# EAGLE design v0.1 (EAGLE 6.5.0)
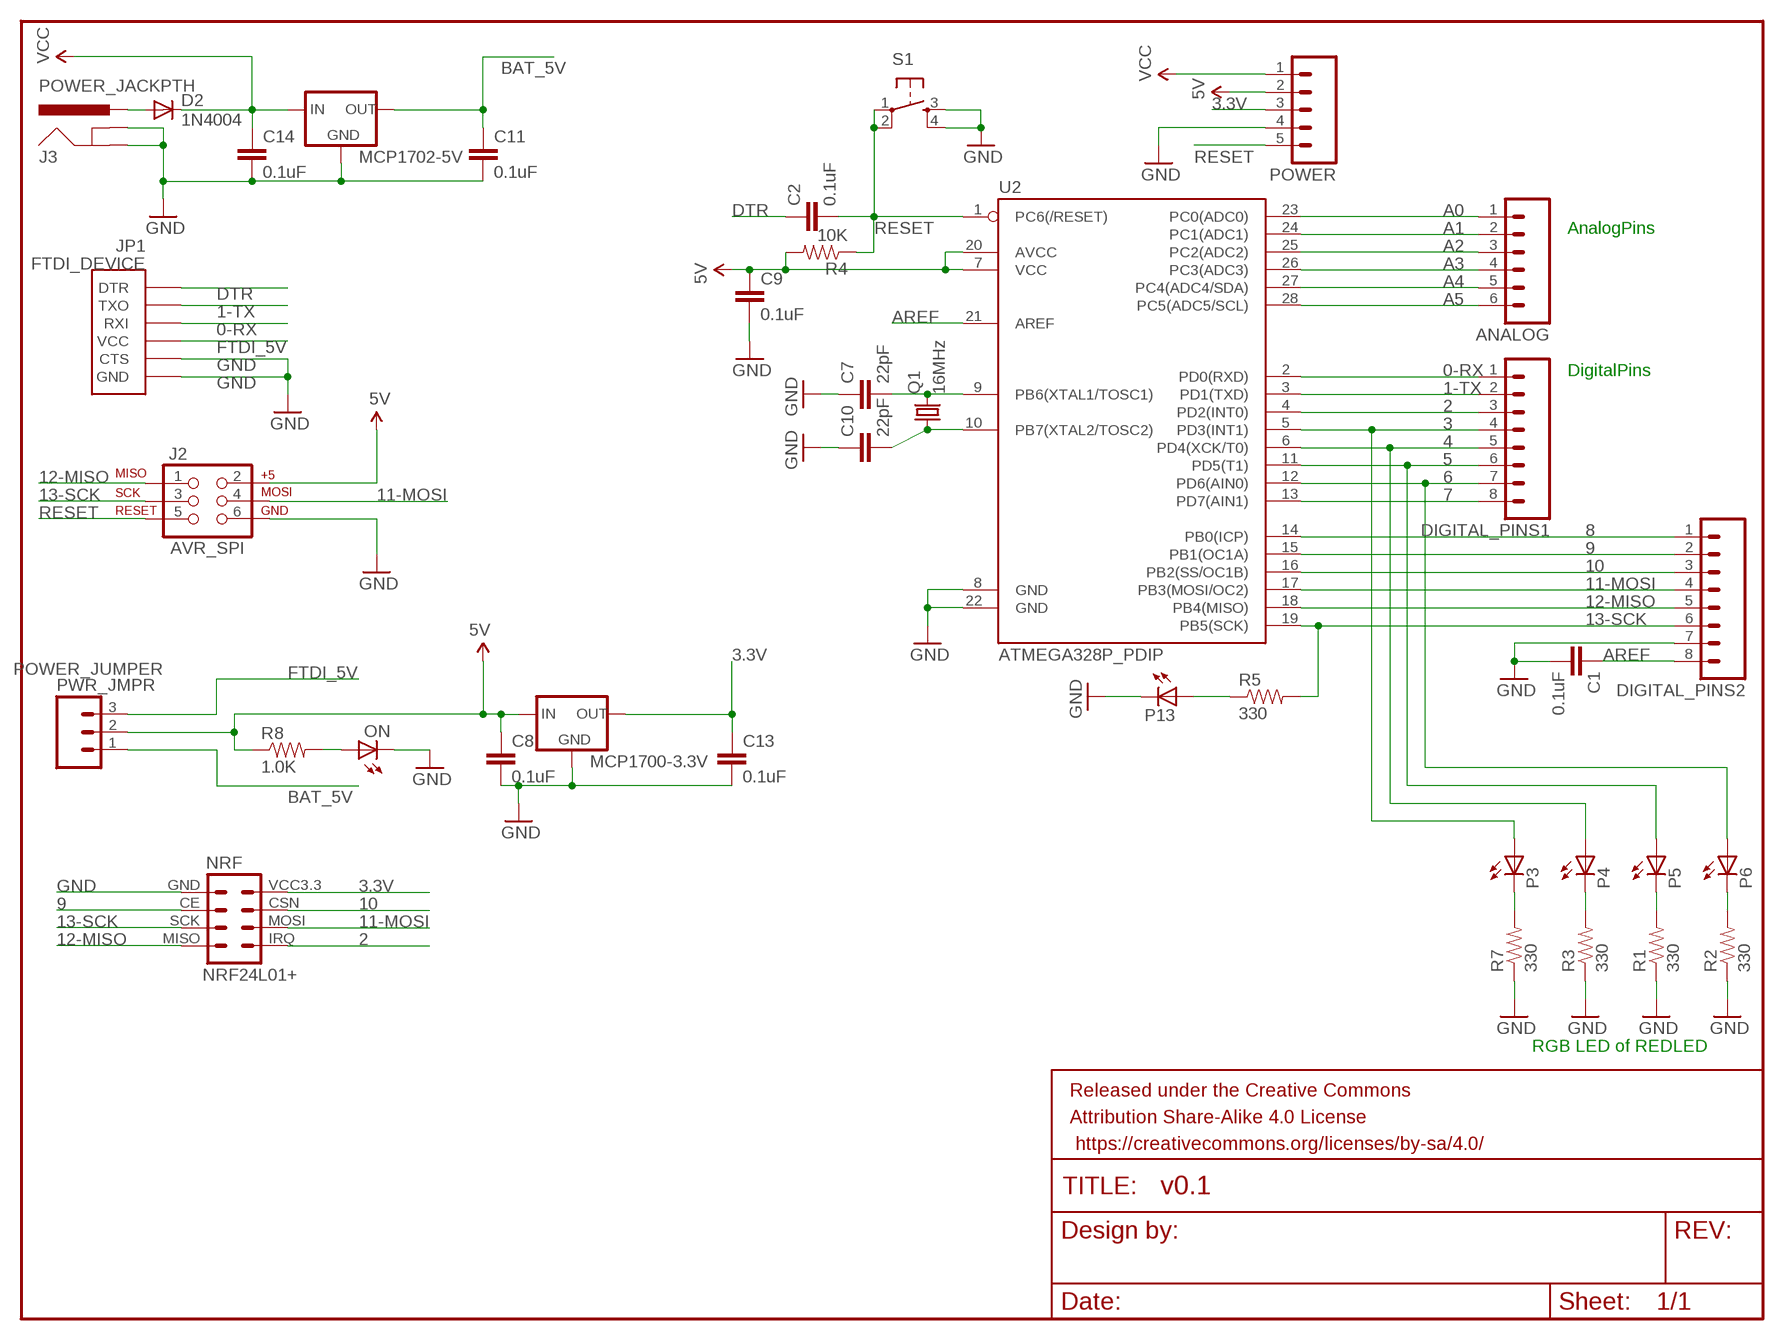
[diagram p0: schematic, sheet 1]

## Parts
ANALOG  M06LOCK  [1X06_LOCK]
C1  0.1uF  CAPPTH  [CAP-PTH-SMALL]
C2  0.1uF  CAPPTH  [CAP-PTH-SMALL]
C7  22pF  CAPPTH  [CAP-PTH-SMALL]
C8  0.1uF  CAPPTH  [CAP-PTH-SMALL]
C9  0.1uF  CAPPTH  [CAP-PTH-SMALL]
C10  22pF  CAPPTH  [CAP-PTH-SMALL]
C11  0.1uF  CAPPTH  [CAP-PTH-SMALL]
C13  0.1uF  CAPPTH  [CAP-PTH-SMALL]
C14  0.1uF  CAPPTH  [CAP-PTH-SMALL]
D2  1N4004  [DO41-10]
DIGITAL_PINS1  M08LOCK  [1X08_LOCK]
DIGITAL_PINS2  M08LOCK  [1X08_LOCK]
FRAME1  FRAME-LETTER  [CREATIVE_COMMONS]
J2  AVR_SPI  AVR_SPI_PRG_6PTH  [2X3]
J3  POWER_JACKPTH  [POWER_JACK_PTH]
JP1  FTDI_DEVICE  [FTDI_DEVICE_SIDE]
MCP1700-3.3V  MCP1700INLINE  [TO92-INLINE]
MCP1702-5V  MCP1700INLINE  [TO92-INLINE]
NRF  NRF24L01+  [2X4]
ON  LED3MM  [LED3MM]
P3  LED5MM  [LED5MM]
P4  LED5MM  [LED5MM]
P5  LED5MM  [LED5MM]
P6  LED5MM  [LED5MM]
P13  LED3MM  [LED3MM]
POWER  M05LOCK  [1X05_LOCK]
PWR_JMPR  M03LOCK  [1X03_LOCK]
Q1  16MHz  CRYSTALHC49S  [HC49/S]
R1  330  RESISTORPTH-1/4W  [AXIAL-0.4]
R2  330  RESISTORPTH-1/4W  [AXIAL-0.4]
R3  330  RESISTORPTH-1/4W  [AXIAL-0.4]
R4  10K  RESISTORPTH-1/4W  [AXIAL-0.4]
R5  330  RESISTORPTH-1/4W  [AXIAL-0.4]
R7  330  RESISTORPTH-1/4W  [AXIAL-0.4]
R8  1.0K  RESISTORPTH-1/4W  [AXIAL-0.4]
S1  TAC_SWITCHPTH  [TACTILE-PTH]
U2  ATMEGA328P_PDIP  [DIL28-3]

## Nets
0-RX: DIGITAL_PINS1.1 JP1.P$3(RXI) U2.2(PD0(RXD))
1-TX: DIGITAL_PINS1.2 JP1.P$2(TXO) U2.3(PD1(TXD))
2: DIGITAL_PINS1.3 NRF.IRQ U2.4(PD2(INT0))
3: DIGITAL_PINS1.4 P3.A U2.5(PD3(INT1))
3.3V: C13.1 MCP1700-3.3V.3(OUT) NRF.VCC3.3(VCC) POWER.3
4: DIGITAL_PINS1.5 P4.A U2.6(PD4(XCK/T0))
5: DIGITAL_PINS1.6 P5.A U2.11(PD5(T1))
5V: C8.1 C9.1 J2.2 MCP1700-3.3V.2(IN) POWER.2 PWR_JMPR.2 R4.P$2 R8.P$1 U2.7(VCC) U2.20(AVCC)
6: DIGITAL_PINS1.7 P6.A U2.12(PD6(AIN0))
7: DIGITAL_PINS1.8 U2.13(PD7(AIN1))
8: DIGITAL_PINS2.1 U2.14(PB0(ICP))
9: DIGITAL_PINS2.2 NRF.CE U2.15(PB1(OC1A))
10: DIGITAL_PINS2.3 NRF.CSN U2.16(PB2(SS/OC1B))
11-MOSI: DIGITAL_PINS2.4 J2.4 NRF.MOSI U2.17(PB3(MOSI/OC2))
12-MISO: DIGITAL_PINS2.5 J2.1 NRF.MISO U2.18(PB4(MISO))
13-SCK: DIGITAL_PINS2.6 J2.3 NRF.SCK R5.P$2 U2.19(PB5(SCK))
A0: ANALOG.1 U2.23(PC0(ADC0))
A1: ANALOG.2 U2.24(PC1(ADC1))
A2: ANALOG.3 U2.25(PC2(ADC2))
A3: ANALOG.4 U2.26(PC3(ADC3))
A4: ANALOG.5 U2.27(PC4(ADC4/SDA))
A5: ANALOG.6 U2.28(PC5(ADC5/SCL))
AREF: C1.1 DIGITAL_PINS2.8 U2.21(AREF)
B: P5.K(C) R1.P$2
B1: P3.K(C) R7.P$2
BAT_5V: C11.1 MCP1702-5V.3(OUT) PWR_JMPR.1
DTR: C2.1 JP1.P$1(DTR)
FTDI_5V: JP1.P$4(VCC) PWR_JMPR.3
GND: C1.2 C7.1 C8.2 C9.2 C10.1 C11.2 C13.2 C14.2 DIGITAL_PINS2.7 J2.6 J3.GND J3.GNDBREAK JP1.P$5(CTS) JP1.P$6(GND) MCP1700-3.3V.1(GND) MCP1702-5V.1(GND) NRF.GND ON.K(C) P13.K(C) POWER.4 R1.P$1 R2.P$1 R3.P$1 R7.P$1 S1.3 S1.4 U2.8(GND) U2.22(GND)
N$1: ON.A R8.P$2
N$2: P13.A R5.P$1
N$3: C10.2 Q1.1 U2.10(PB7(XTAL2/TOSC2))
N$4: C7.2 Q1.2 U2.9(PB6(XTAL1/TOSC1))
N$9: D2.A J3.PWR
N$12: P4.K(C) R3.P$2
N$13: P6.K(C) R2.P$2
RESET: C2.2 J2.5 POWER.5 R4.P$1 S1.1 S1.2 U2.1(PC6(/RESET))
VCC: C14.1 D2.C MCP1702-5V.2(IN) POWER.1

## Notes on the sheet
- AnalogPins
- DigitalPins
- RGB LED of REDLED

## Library data of the parts
ANALOG = SparkFun-Connectors:M06: Header 6 Standard 6-pin 0.1" header. Use with straight break away headers (SKU : PRT-00116), right angle break away headers (PRT-00553), swiss pins (PRT-00743), machine pins (PRT-00117), and female headers (PRT-00115). Molex polarized connector foot print use with SKU : PRT-08094 with associated crimp pins and housings. NOTES ON THE VARIANTS LOCK and LOCK_LONGPADS... This footprint was designed to help hold the alignment of a through-hole component (i.e. 6-pin header) while soldering it into place. You may notice that each hole has been shifted either up or down by 0.005 of an inch from it's more standard position (which is a perfectly straight line). This slight alteration caused the pins (the squares in the middle) to touch the edges of the holes. Because they are alternating, it causes a "brace" to hold the component in place. 0.005 has proven to be the perfect amount of "off-center" position when using our standard breakaway headers. Although looks a little odd when you look at the bare footprint, once you have a header in there, the alteration is very hard to notice. Also,if you push a header all the way into place, it is covered up entirely on the bottom side. This idea of altering the position of holes to aid alignment will be further integrated into the Sparkfun Library for other footprints. It can help hold any component with 3 or more connection pins.
C1 C2 C7-C11 C13 C14 = SparkFun-Capacitors:CAP: Capacitor Standard 0603 ceramic capacitor, and 0.1" leaded capacitor.
D2 = adafruit:1N4004: DIODE General purpose 1N400x type rectifier (With bigger pads) http://www.ladyada.net/library/pcb/eaglelibrary.html
DIGITAL_PINS1 DIGITAL_PINS2 = SparkFun-Connectors:M08: Header 8 Standard 8-pin 0.1" header. Use with straight break away headers (SKU : PRT-00116), right angle break away headers (PRT-00553), swiss pins (PRT-00743), machine pins (PRT-00117), and female headers (PRT-00115).
FRAME1 = SparkFun-Aesthetics:FRAME-LETTER: Schematic Frame Standard 8.5x11 US Letter frame
J2 = SparkFun-Connectors:AVR_SPI_PRG_6: AVR ISP 6 Pin This is the reduced ISP connector for AVR programming. Common on Arduino. This footprint will take up less PCB space and can be used with a 10-pin to 6-pin adapter such as SKU: BOB-08508
J3 = SparkFun-Connectors:POWER_JACK: Power Jack This is the standard 5.5mm barrel jack for power. The PTH is the most common, proven, reliable, footprint. The Slot footprint only works if the mill layer is transmitted to the PCB fab house so be warned. Mating wall wart : TOL-00298 (and others); PROD_ID: PRT-00119
JP1 = SparkFun-Connectors:FTDI_DEVICE: Connector which mates to FTDI basic or FTDI cable.
MCP1700-3.3V MCP1702-5V = adafruit:MCP1700: VOLTAGE REGULATOR
NRF = randomdata:NRF24L01+: .1" header, two rows of four.
ON P3-P6 P13 = SparkFun-LED:LED: LEDs Standard schematic elements and footprints for 5mm, 3mm, 1206, and 0603 sized LEDs. 5mm - Spark Fun Electronics SKU : COM-00529 (and others)
POWER = SparkFun-Connectors:M05: Header 5 Standard 5-pin 0.1" header. Use with straight break away headers (SKU : PRT-00116), right angle break away headers (PRT-00553), swiss pins (PRT-00743), machine pins (PRT-00117), and female headers (PRT-00115). Molex polarized connector foot print use with SKU : PRT-08230 with associated crimp pins and housings.
PWR_JMPR = SparkFun-Connectors:M03: Header 3 Standard 3-pin 0.1" header. Use with straight break away headers (SKU : PRT-00116), right angle break away headers (PRT-00553), swiss pins (PRT-00743), machine pins (PRT-00117), and female headers (PRT-00115). Molex polarized connector foot print use with SKU : PRT-08232 with associated crimp pins and housings.
Q1 = crystal:CRYSTAL: CRYSTAL; OC_FARNELL: 1667008; OC_NEWARK: unknown
R1-R5 R7 R8 = SparkFun-Passives:RESISTOR: Resistor Basic schematic elements and footprints for 0603, 1206, and PTH resistors.
S1 = SparkFun-Electromechanical:TAC_SWITCH: Momentary Switch Button commonly used for reset or general input. Spark Fun Electronics SKU : COM-00097 SMT- SWCH-08247
U2 = SparkFun-DigitalIC:ATMEGA328P_PDIP: uC used in the Arduino 32kb flash, 1k EEPROM, 2k SRAM This is the through-hole version of this chip.

## Board
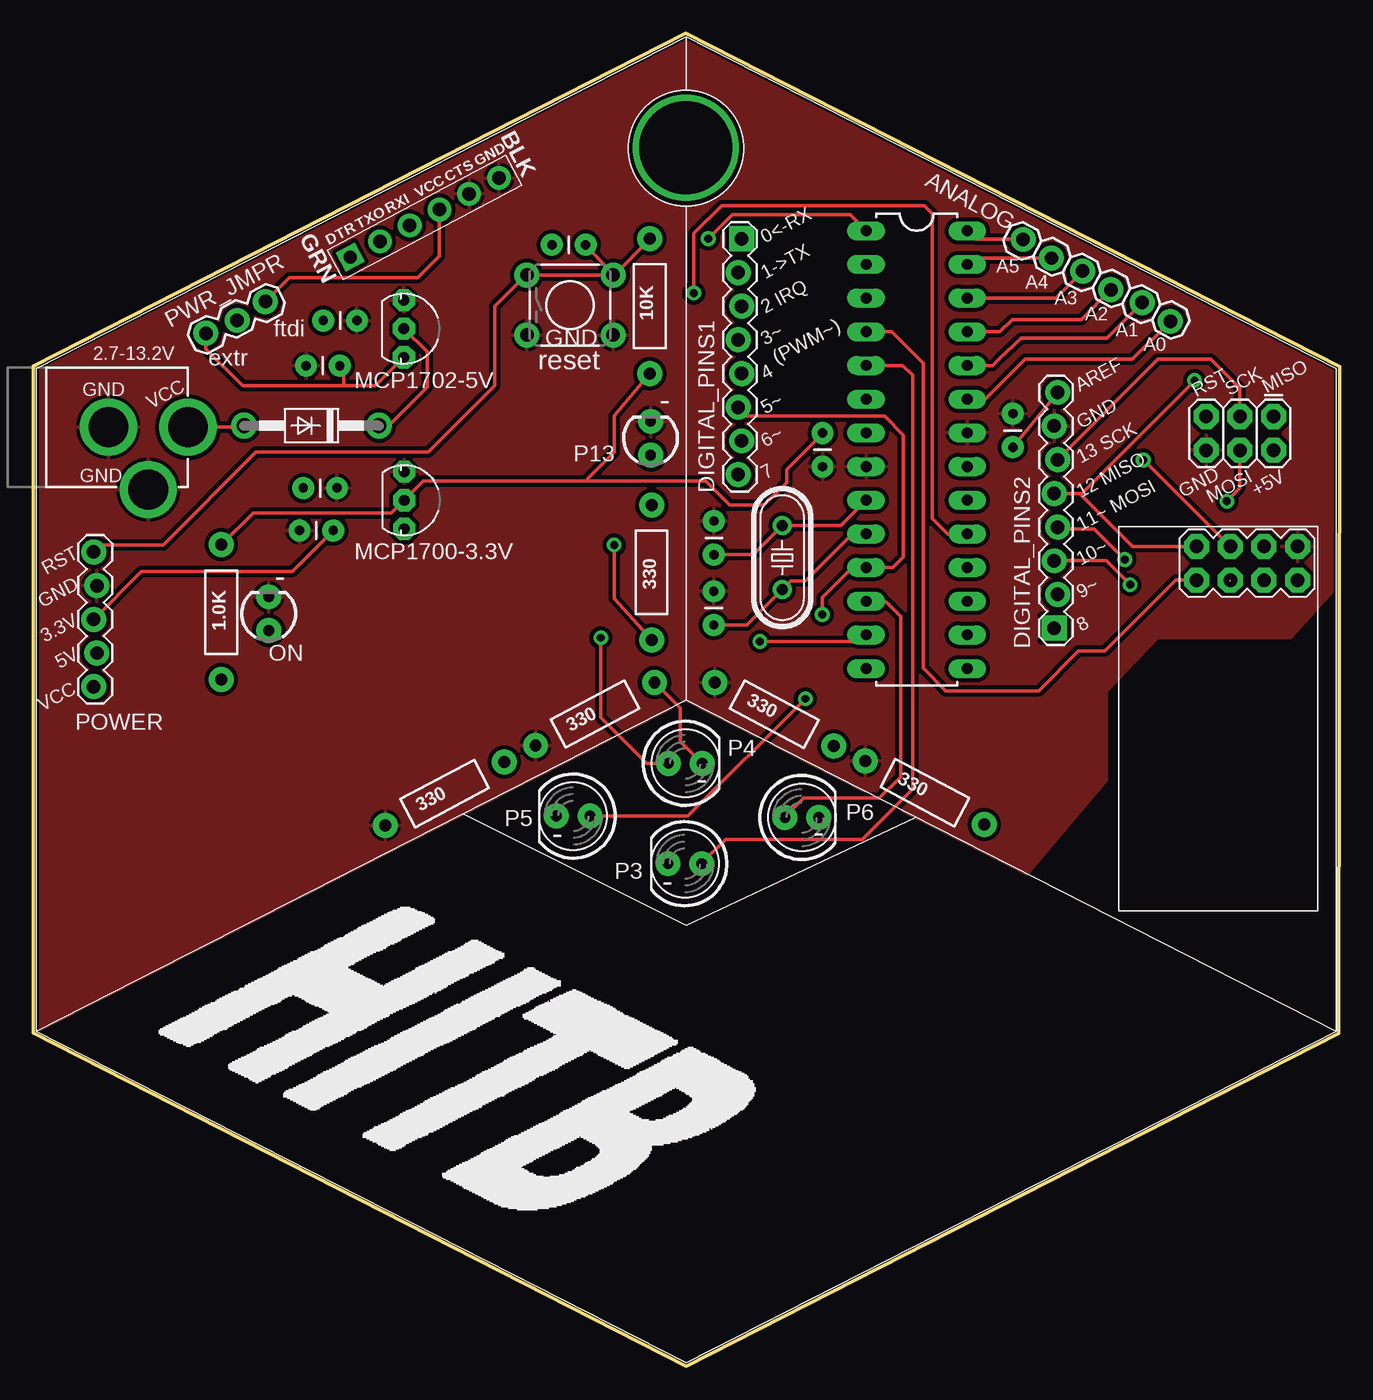
[diagram p1: board, top side]
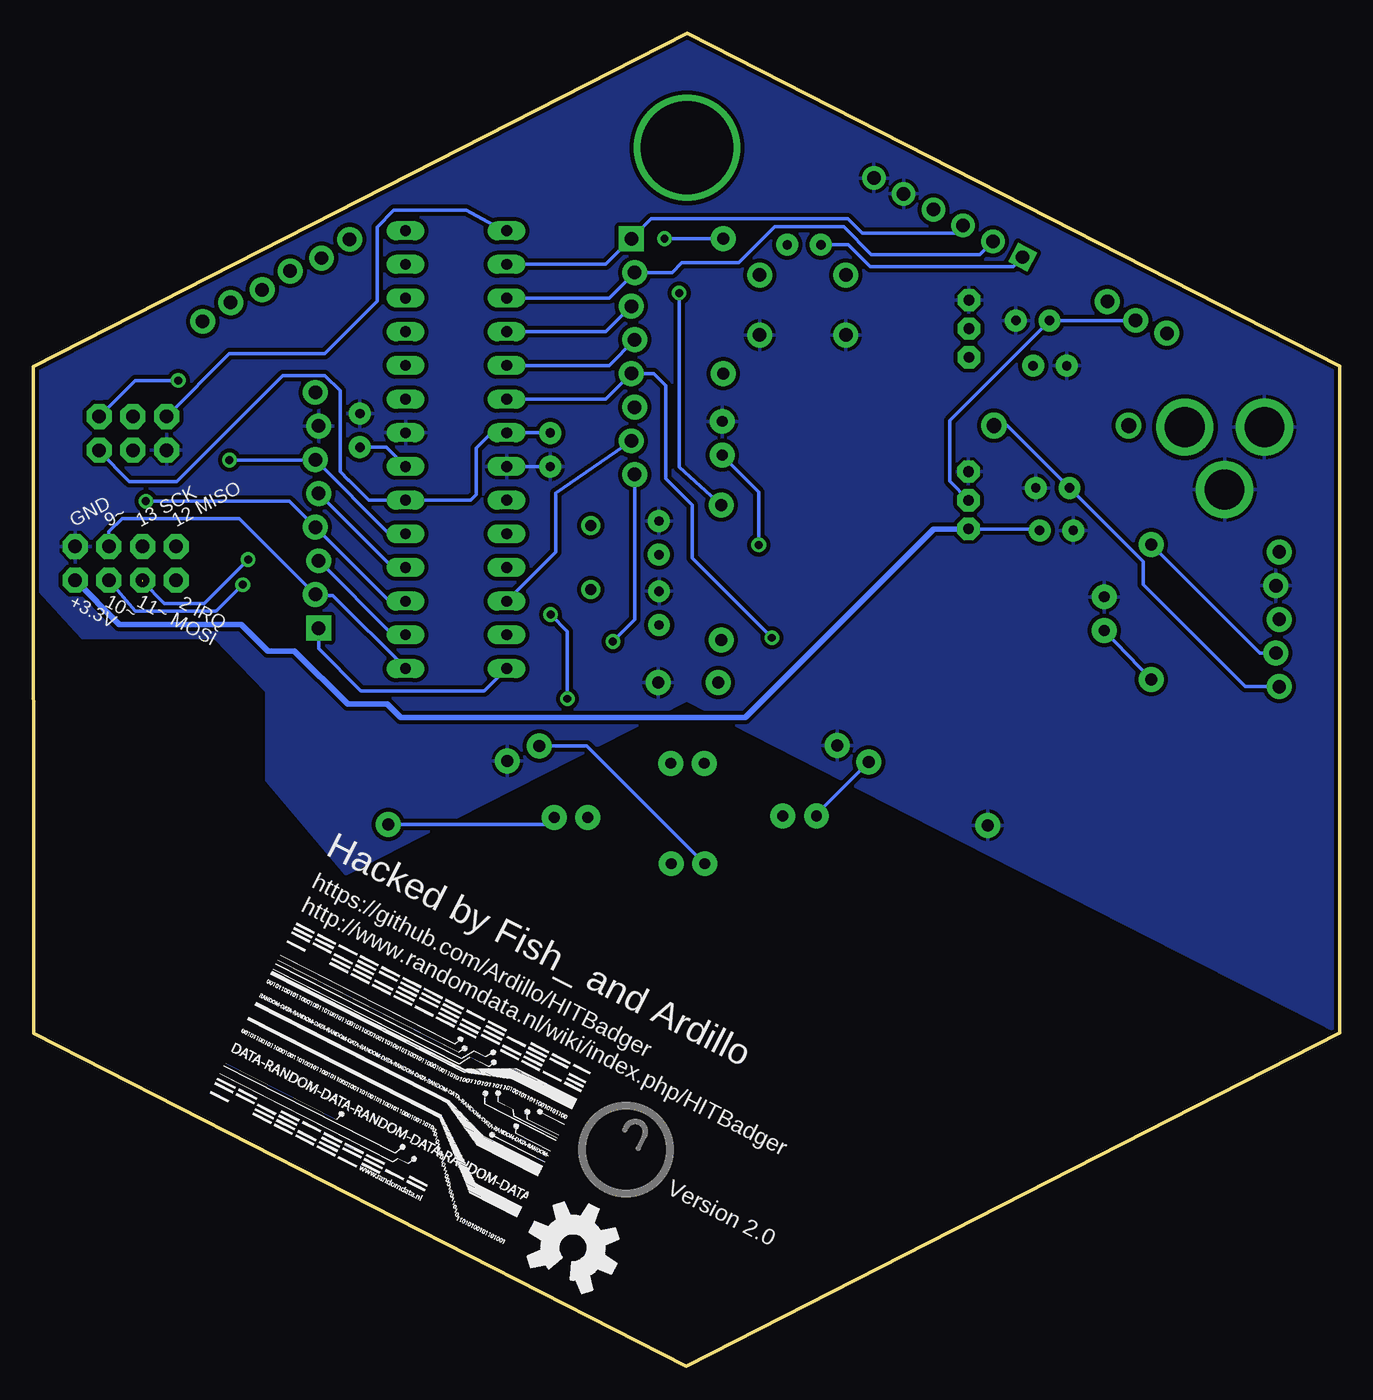
[diagram p2: board, bottom side, seen from below]

Size 98.5 x 100.55 mm. Coordinates in mm from the lower left corner, seen from the top.
Outline: 0,25.15 0,75.45 49.2,100.55 98.5,75.4 98.45,25.1 49.25,0 0,25.15
Copper layers (1*16): Top 0.035mm / dielectric 1.5mm / Bottom 0.035mm
Design rules "SparkFun": minimum track width 8mil, minimum drill 20mil, track to track 8mil, track to pad 8mil, pad to pad 8mil, via to via 8mil, smd to smd 8mil, copper to edge 8mil, drill to drill 8mil, minimum pad ring 12mil, minimum via ring 10mil, stop-mask expansion 4mil, vias tented up to drill 20mil, thermal gap 10mil

### Footprints (pad centres in the part's own frame; a part is rotated, then mirrored left to right if it is on the bottom)
1X06_LOCK = drill 1.016 pad 1.88: 1 0,0; 2 2.54,-0.254; 3 5.08,0; 4 7.62,-0.254; 5 10.16,0; 6 12.7,-0.254
CAP-PTH-SMALL = drill 0.7 pad 1.651: 1 0,0; 2 2.54,0
DO41-10 = drill 1.118 pad 1.93: A 5.08,0; C -5.08,0
1X08_LOCK = drill 1.016 pad 1.88 square: 1 0,0.127 | drill 1.016 pad 1.88: 2 2.54,-0.127; 3 5.08,0.127; 4 7.62,-0.127; 5 10.16,0.127; 6 12.7,-0.127; 7 15.24,0.127; 8 17.78,-0.127
2X3 = drill 1.016 pad 1.88 octagon: 1 0,0; 2 0,2.54; 3 2.54,0; 4 2.54,2.54; 5 5.08,0; 6 5.08,2.54
POWER_JACK_PTH = drill 2.997 pad 4.318: GND 0,7.7; GNDBREAK 4.7,10.7; PWR 0,13.7
FTDI_DEVICE_SIDE = drill 1 square: P$1 -6.35,0 | drill 1.016 pad 1.778: P$2 -3.81,0; P$3 -1.27,0; P$4 1.27,0; P$5 3.81,0; P$6 6.35,0
TO92-INLINE = drill 0.813 pad 1.676 octagon: 1 -2.159,0; 2 0,0; 3 2.159,0
2X4 = drill 1.016 pad 1.88 octagon: CE 3.45,12.99; CSN 3.45,10.45; GND 5.99,12.99; IRQ -1.63,10.45; MISO -1.63,12.99; MOSI 0.91,10.45; SCK 0.91,12.99; VCC3.3 5.99,10.45
LED3MM = drill 0.813 pad 1.88: A -1.27,0; K 1.27,0
LED5MM = drill 0.813 pad 1.88: A -1.27,0; K 1.27,0
1X05_LOCK = drill 1.016 pad 1.88: 1 0,0.127; 2 2.54,-0.127; 3 5.08,0.127; 4 7.62,-0.127; 5 10.16,0.127
1X03_LOCK = drill 1.016 pad 1.88: 1 0,0.127; 2 2.54,-0.127; 3 5.08,0.127
HC49/S = drill 0.813: 1 -2.413,0; 2 2.413,0
AXIAL-0.4 = drill 0.9 pad 1.88: P$1 -5.08,0; P$2 5.08,0
TACTILE-PTH = drill 1.016 pad 1.88: 1 -3.251,2.261; 2 3.251,2.261; 3 -3.251,-2.261; 4 3.251,-2.261
DIL28-3 = drill 0.813 long: 1 -16.51,-3.81; 2 -13.97,-3.81; 3 -11.43,-3.81; 4 -8.89,-3.81; 5 -6.35,-3.81; 6 -3.81,-3.81; 7 -1.27,-3.81; 8 1.27,-3.81; 9 3.81,-3.81; 10 6.35,-3.81; 11 8.89,-3.81; 12 11.43,-3.81; 13 13.97,-3.81; 14 16.51,-3.81; 15 16.51,3.81; 16 13.97,3.81; 17 11.43,3.81; 18 8.89,3.81; 19 6.35,3.81; 20 3.81,3.81; 21 1.27,3.81; 22 -1.27,3.81; 23 -3.81,3.81; 24 -6.35,3.81; 25 -8.89,3.81; 26 -11.43,3.81; 27 -13.97,3.81; 28 -16.51,3.81
HITB_LOGO = drill 7 pad 7.7: P$1 -0.024,41.644

### Placement (x,y rotation side)
ANALOG  85.73,78.81 152 top
C1  73.87,69.32 90 top
C2  39.11,84.58 0 top
C7  51.32,63.76 270 top
C8  21.87,78.88 0 top
C9  59.51,70.4 270 top
C10  51.31,58.46 270 top
C11  23.11,75.46 180 top
C13  22.62,63.05 180 top
C14  20.37,66.25 0 top
D2  20.99,70.95 180 top
DIGITAL_PINS1  53.28,85.04 270 top
DIGITAL_PINS2  77.1,55.68 90 top
FRAME1  21.28,-9.83 0 top  (outside the outline)
J2  93.52,71.64 180 top
J3  -2.03,70.83 270 top
JP1  29.51,86.64 28 top
MCP1700-3.3V  27.98,65.32 270 top
MCP1702-5V  27.95,78.26 270 top
NRF  89.34,48.84 0 top
ON  17.75,56.77 90 top
P3  49.13,37.91 180 top
P4  49.17,45.48 0 top
P5  40.71,41.5 180 top
P6  57.95,41.4 0 top
P13  46.55,70 90 top
POWER  4.68,51.26 90 top
PWR_JMPR  13.08,77.81 28 top
Q1  56.47,60.99 90 top
R1  31.02,43.19 28 top
R2  67.23,43.27 332 top
R3  42.36,49.21 28 top
R4  46.48,79.96 270 top
R5  46.62,59.87 90 top
R7  55.87,49.18 332 top
R8  14.19,56.89 270 top
S1  40.47,80.04 0 top
U2  66.61,69.14 270 top
U$1  [HITB_LOGO]  49.23,50.26 0 top
U$2  [HITB]  10.18,24.58 0 top
U$3  [OSHW-LOGO-L]  57.8,8.95 333 bottom
U$4  [OSHWLOGO_0.3]  53.8,16.35 333 bottom
U$6  [RANDOMDATA_LOGO_M]  85.6,19.75 333 bottom

### Tracks (layer width: path | path; a pad name or v marks a point on that pad's centre or on a via)
0-RX
  Bottom 0.254: JP1.P$3 28.41,86.05 29,85.45 36,85.45 37.1,86.55 51.9,86.55 DIGITAL_PINS1.1 55.34,83.11 U2.2
1-TX
  Bottom 0.254: JP1.P$2 27.15,83.85 35.3,83.85 37.4,85.95 42.6,85.95 45.31,83.24 49.58,83.24 50.33,82.5 DIGITAL_PINS1.2 55.08,80.57 U2.3
2
  Top 0.254: U2.4 64.72,78.03 67.1,75.65 67.1,52.65 68.8,50.95 75.8,50.95 78.8,53.95 80.8,53.95 86.14,59.29 NRF.IRQ
  Bottom 0.254: DIGITAL_PINS1.3 55.34,78.03 U2.4
3
  Top 0.254: U2.5 65.56,75.49 66.3,74.75 66.3,43.55 62.5,39.75 52.2,39.75 50.4,37.95 P3.A
  Bottom 0.254: DIGITAL_PINS1.4 55.08,75.49 U2.5
3.3V
  Top 0.254: C13.1 19.53,59.95 8.16,59.95 POWER.3
  Bottom 0.254: MCP1700-3.3V.3 22.74,63.16 C13.1
  Bottom 0.406: NRF.VCC3.3 91.99,55.95 82.8,55.95 80.8,53.95 78.8,53.95 74.8,49.95 71.8,49.95 70.8,48.95 44.8,48.95 30.59,63.16 MCP1700-3.3V.3
4  (via drill 0.6)
  Top 0.254: v42.8,54.95 42.8,48.95 46.27,45.48 P4.A
  Bottom 0.254: v42.8,54.95 48.8,60.95 48.8,64.95 50.8,66.95 50.8,73.95 51.73,74.88 DIGITAL_PINS1.5 55.34,72.95 U2.6
5  (via drill 0.6)
  Top 0.254: v59.49,56.7 59.49,57.97 61.77,60.25 U2.11 64.8,60.25 65.6,61.05 65.6,70.25 64.2,71.65 53.84,71.65 DIGITAL_PINS1.6 | v58.22,50.35 58.2,50.35 49.35,41.5 P5.A
  Bottom 0.254: v58.22,50.35 58.22,55.43 v59.49,56.7
5V
  Top 0.254: C9.1 59.51,70.36 56.8,67.65 56.8,66.65 55.1,64.95 52.5,64.95 50.7,66.75 41.8,66.75 | R4.P$2 43.8,71.7 43.8,68.95 41.8,66.95 41.8,66.75 | R8.P$1 16.57,64.35 27.01,64.35 MCP1700-3.3V.2 29.41,66.75 41.8,66.75
  Bottom 0.254: J2.2 93.52,69.01 91.24,66.73 87.68,66.73 79.68,74.73 76.51,74.73 75.36,73.59 75.36,67.5 74.73,66.86 74.71,66.86 73.2,65.35 70.44,65.35 U2.20 70.4,65.35 65.5,65.35 65.1,65.75 65.1,69.25 63.94,70.41 U2.7 59.53,70.41 C9.1 | POWER.2 6.02,53.8 R8.P$1 | MCP1700-3.3V.2 29.41,66.75 29.41,71.34 C8.1 PWR_JMPR.2
6
  Top 0.254: U2.12 62.86,57.65 64.3,57.65 65.4,56.55 65.4,44.45 63.8,42.85 58.1,42.85 56.68,41.43 P6.A
  Bottom 0.254: U2.12 59.11,61.4 59.11,65.84 DIGITAL_PINS1.7
7  (via drill 0.6)
  Top 0.254: U2.13 62.3,54.67 v54.79,54.67
  Bottom 0.254: v54.79,54.67 53.14,56.32 53.15,56.32 DIGITAL_PINS1.8
8
  Bottom 0.254: DIGITAL_PINS2.1 76.98,54.13 73.8,50.95 64.48,50.95 U2.14
9
  Bottom 0.254: NRF.CE 92.79,62.96 91.8,63.95 82.96,63.95 DIGITAL_PINS2.2 77.16,58.15 75.9,58.15 70.42,52.67 U2.15
10  (via drill 0.6)
  Top 0.254: DIGITAL_PINS2.3 80.89,60.76 v82.7,58.95
  Bottom 0.254: NRF.CSN 90.8,56.95 84.7,56.95 v82.7,58.95 | DIGITAL_PINS2.3 71.39,55.17 U2.16
11-MOSI  (via drill 0.6)  (1 unrouted)
  Top 0.254: J2.4 90.98,66.23 v90,65.25 | v82.3,60.85 80,63.15 77.38,63.15 DIGITAL_PINS2.4
  Bottom 0.254: v90,65.25 79.18,65.25 DIGITAL_PINS2.4 71.64,57.71 U2.17 | 90.25,59.2 88.6,57.55 85.6,57.55 v82.3,60.85
12-MISO  (via drill 0.6)
  Top 0.254: v87.56,74.35 79.04,65.84 78.9,65.84 | 78.9,65.84 DIGITAL_PINS2.5 | NRF.MISO 82.91,61.83 78.9,65.84
  Bottom 0.254: DIGITAL_PINS2.5 71.39,60.25 U2.18 | v87.56,74.35 90.81,74.35 J2.1
13-SCK  (via drill 0.6)
  Top 0.254: J2.3 90.98,73.77 88.8,75.95 84.8,75.95 DIGITAL_PINS2.6 | U2.19 68.96,62.79 67.8,63.95 67.8,86.95 67.2,87.55 51.9,87.55 49.8,85.45 v49.8,80.95 | v83.7,68.35 83.74,68.35 NRF.SCK
  Bottom 0.254: R5.P$2 49.8,67.83 v49.8,80.95 | U2.19 71.64,62.79 DIGITAL_PINS2.6 77.26,68.35 v83.7,68.35
A0
  Top 0.254: U2.23 71.8,72.95 74.8,75.95 81.8,75.95 82.8,75.95 82.87,75.95 ANALOG.1
A1
  Top 0.254: U2.24 72.34,75.49 72.8,75.95 74.5,77.55 80.93,77.55 ANALOG.2
A2
  Top 0.254: U2.25 72.88,78.03 73.8,78.95 79,78.95 ANALOG.3
A3
  Top 0.254: ANALOG.4 77.08,80.57 U2.26
A4
  Top 0.254: U2.27 70.89,83.58 ANALOG.5
A5
  Top 0.254: U2.28 71.08,85 ANALOG.6
AREF
  Top 0.254: DIGITAL_PINS2.8 C1.1
  Bottom 0.254: U2.21 71.87,69.32 C1.1
B
  Bottom 0.254: P5.K 39.44,41.64 R1.P$2
B1
  Bottom 0.254: R7.P$2 56.75,46.8 P3.K
BAT_5V
  Top 0.254: PWR_JMPR.1 13.02,76.73 15.8,73.95 23.4,73.95 | 23.4,73.95 25.8,73.95 MCP1702-5V.3 | C11.1 23.4,75.18 23.4,73.95
DTR
  Bottom 0.254: C2.1 37.03,84.58 35.4,82.95 24.61,82.95 JP1.P$1
FTDI_5V
  Top 0.254: JP1.P$4 30.63,83.72 29.01,82.1 19.3,82.1 PWR_JMPR.3
GND
  Bottom 0.254: U2.8 59.53,67.87 C9.2
  pour Top (isolate 0.305): 49.2,100.52 98.48,75.37 98.45,58.95 94.8,54.95 84.8,54.95 80.9,50.9 80.9,44.2 74.95,37.15 66.55,41.43 49.23,50.26 32.4,41.65 0.05,25.2 0.05,75.37
  pour Bottom (isolate 0.305): 49.2,100.52 98.48,75.37 98.45,58.95 94.8,54.95 84.8,54.95 80.9,50.9 80.9,44.2 74.95,37.15 66.55,41.43 49.23,50.26 32.4,41.65 0.05,25.2 -0.07,75.5
N$1
  Bottom 0.254: ON.A R8.P$2
N$2  (via drill 0.6)
  Top 0.254: R5.P$1 43.8,57.91 v43.8,61.95
  Bottom 0.254: v43.8,61.95 43.8,65.95 46.55,68.7 P13.A
N$3
  Top 0.254: U2.10 61.77,62.79 58.22,59.24 57.13,59.24 Q1.1 53.81,55.92 C10.2
N$4
  Top 0.254: U2.9 60.88,63.41 Q1.2 54.28,61.22 C7.2
N$9
  Top 0.254: J3.PWR 15.79,70.83 D2.A
N$12
  Top 0.254: P4.K 48.8,47.12 48.8,49.65 46.86,51.59 R3.P$2
N$13
  Bottom 0.254: P6.K 59.73,40.88 R2.P$2
RESET  (via drill 0.6)
  Top 0.254: S1.2 43.84,82.3 R4.P$1 | S1.2 S1.1 37.15,82.3 34.8,79.95 34.8,73.95 29.8,68.95 16.8,68.95 9.8,61.95 5.08,61.95 POWER.5 | v50.9,85.05 52.7,86.85 61.6,86.85 U2.1 | C2.2 S1.2
  Bottom 0.254: J2.5 83.7,76.39 76.51,76.39 72.57,80.32 72.57,85.91 71.3,87.18 65.84,87.18 63.04,85.65 U2.1 | R4.P$1 46.99,85.05 v50.9,85.05
VCC
  Top 0.254: D2.C 26.8,70.95 29.7,73.85 29.7,76.51 MCP1702-5V.2
  Bottom 0.254: POWER.1 7.11,51.26 14.8,58.95 14.8,60.68 C14.1 25.06,70.95 D2.C

### Text on the board
tPlace: reset
tNames: 0<-RX | A5 | 1->TX | A4 | A3 | 2 IRQ | A2 | ftdi | A1 | GND | 3~ | A0 | 2.7-13.2V | (PWM~) | extr | 4 | GND | AREF | RST | SCK | MISO | VCC | - | 5~ | GND | 6~ | 13 SCK | GND | 7 | +5V | 12 MISO | GND | MOSI | 11~ MOSI | RST | 10~ | - | 9~ | GND | 3.3V | 8 | 5V | VCC | - | - | - | -
bNames: 12 MISO | 13 SCK | 9~ | GND | 2 IRQ | 11~ MOSI | 10~ | +3.3V | https://github.com/Ardillo/HITBadger | Hacked by Fish_ and Ardillo | http://www.randomdata.nl/wiki/index.php/HITBadger | Version 2.0